# EAGLE design HAN_DE10-Lite_PS2SpeakerShield_001 (EAGLE 9.6.0)
CNAME: PS/2 keyboard shield for DE10-Lite; CREVISION: 1.0; DESIGNER: remko.welling@han.nl
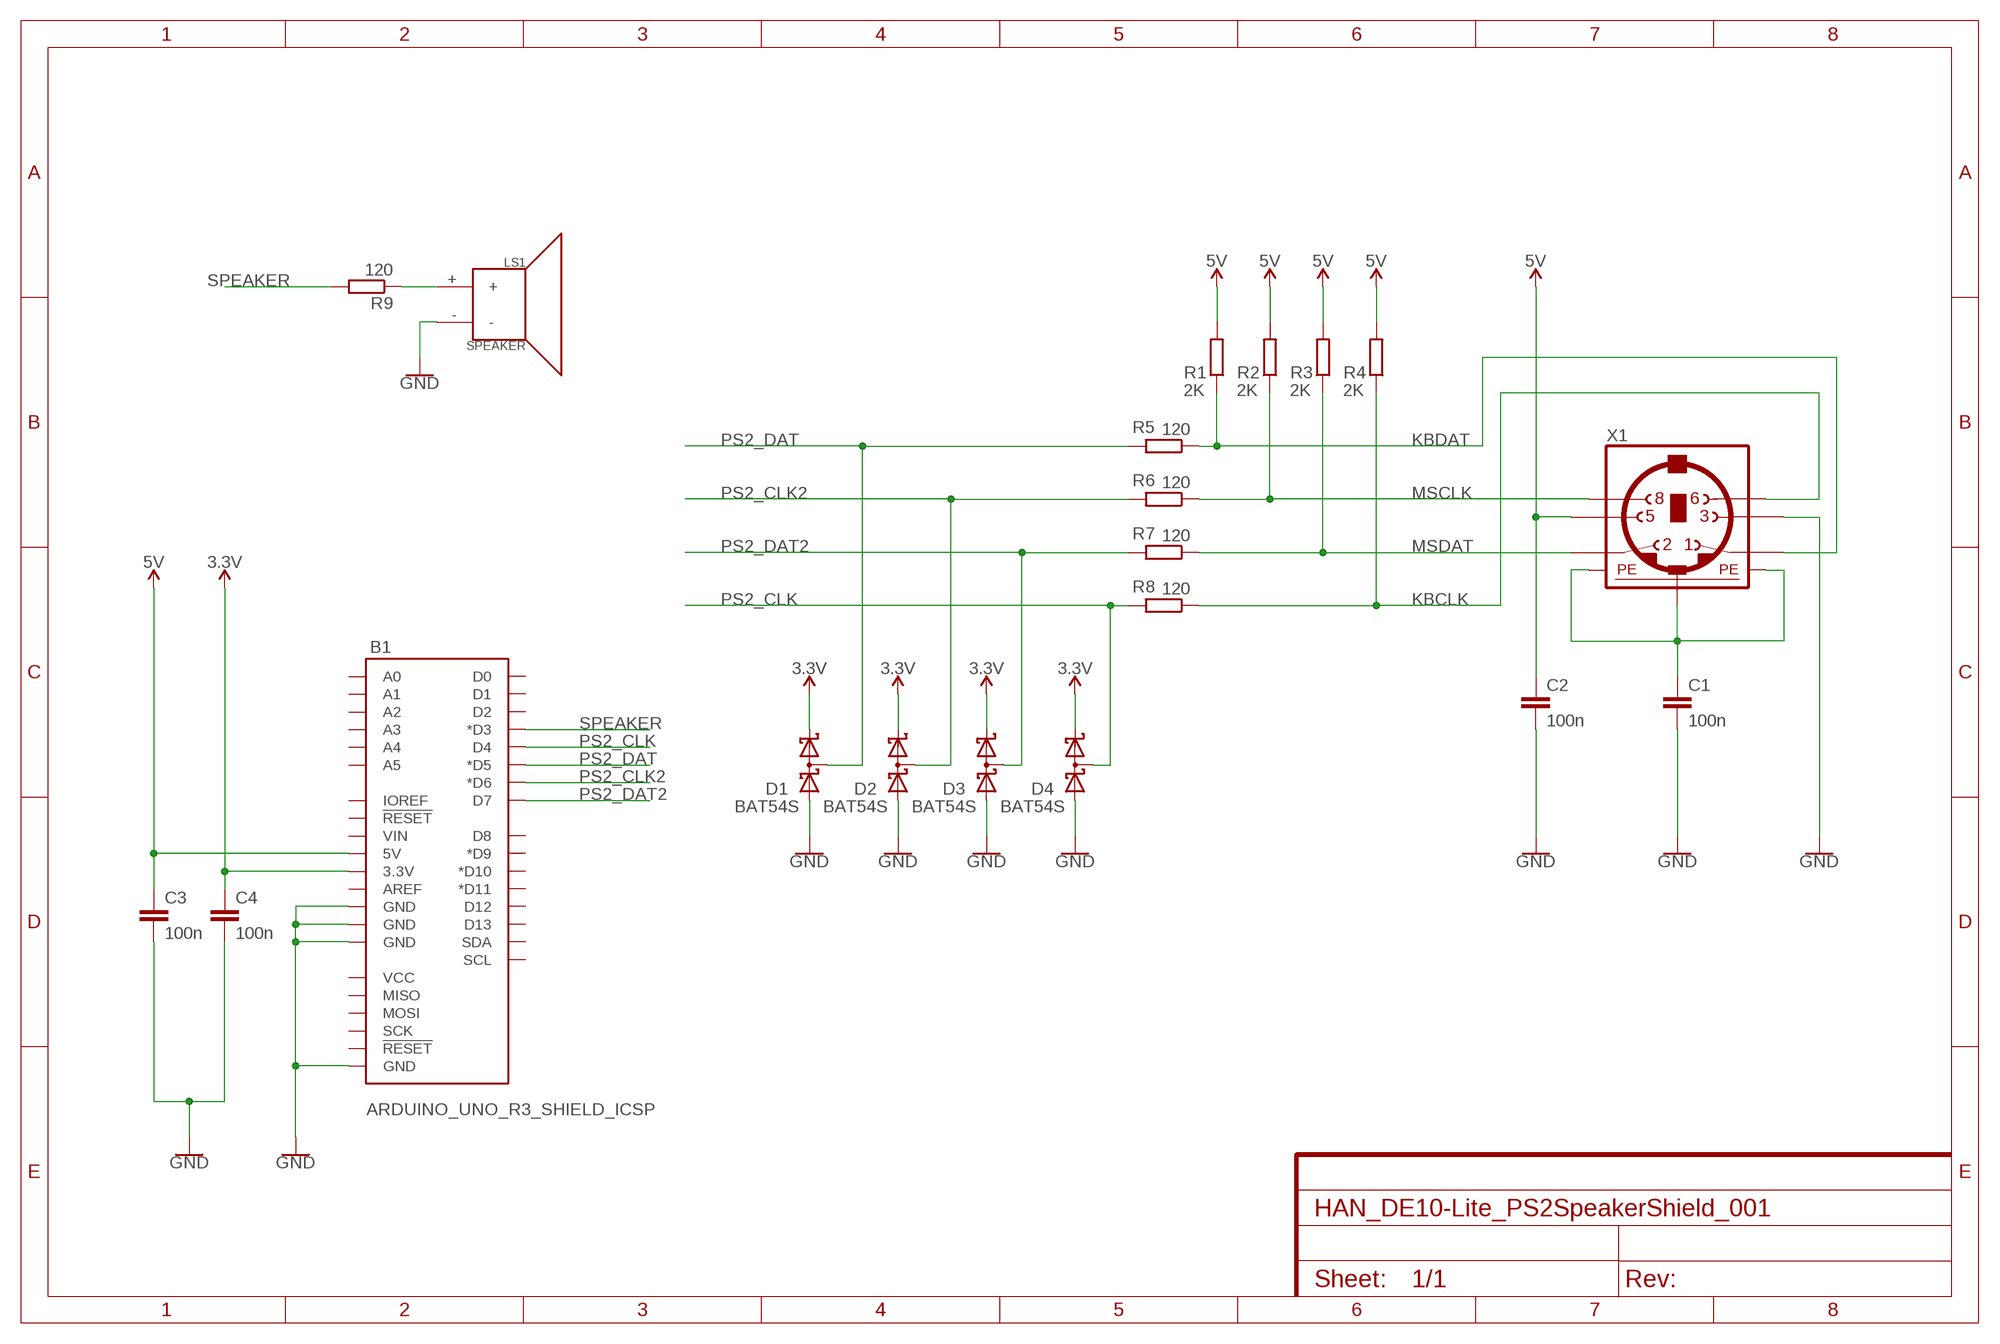
[diagram p0: schematic, sheet 1]

## Parts
B1  ARDUINO_UNO_R3_SHIELD_ICSP  [UNO_R3_SHIELD_ICSP]
C1  100n  C-EUC1206  [C1206]
C2  100n  C-EUC1206  [C1206]
C3  100n  C-EUC1206  [C1206]
C4  100n  C-EUC1206  [C1206]
D1  BAT54S  [SOT23]
D2  BAT54S  [SOT23]
D3  BAT54S  [SOT23]
D4  BAT54S  [SOT23]
LS1  SPEAKER  [PCB_MOUNT_SPEAKER]
R1  2K  R-EU_M1206  [M1206]
R2  2K  R-EU_M1206  [M1206]
R3  2K  R-EU_M1206  [M1206]
R4  2K  R-EU_M1206  [M1206]
R5  120  R-EU_M1206  [M1206]
R6  120  R-EU_M1206  [M1206]
R7  120  R-EU_M1206  [M1206]
R8  120  R-EU_M1206  [M1206]
R9  120  R-EU_M1206  [M1206]
X1  MINI_DIN_6  [M_DIN6]

## Nets
3.3V: B1.3.3V C4.1 D1.2(K2) D2.2(K2) D3.2(K2) D4.2(K2)
5V: B1.5V C2.1 C3.1 R1.2 R2.2 R3.2 R4.2 X1.5
GND: B1.GND@0(GND) B1.GND@1(GND) B1.GND@2(GND) B1.GND_ICSP(GND) C1.2 C2.2 C3.2 C4.2 D1.1(A1) D2.1(A1) D3.1(A1) D4.1(A1) LS1.- X1.3
KBCLK: R4.1 R8.1 X1.6
KBDAT: R1.1 R5.1 X1.1
MSCLK: R2.1 R6.1 X1.8
MSDAT: R3.1 R7.1 X1.2
N$2: LS1.+ R9.1
N$5: C1.1 X1.SH1(PE1) X1.SH2(PE2) X1.SH3(PE3)
PS2_CLK: B1.D4 D4.3(K1A2) R8.2
PS2_CLK2: B1.D6(*D6) D2.3(K1A2) R6.2
PS2_DAT: B1.D5(*D5) D1.3(K1A2) R5.2
PS2_DAT2: B1.D7 D3.3(K1A2) R7.2
SPEAKER: B1.D3(*D3) R9.2
Unconnected: B1.5V_ICSP(VCC) B1.A0 B1.A1 B1.A2 B1.A3 B1.A4 B1.A5 B1.AREF B1.D2 B1.D8 B1.D9(*D9) B1.D10(*D10) B1.D11(*D11) B1.D12 B1.D13 B1.IOREF B1.MISO B1.MOSI B1.RES(!RESET!) B1.RST_ICSP(!RESET!) B1.RX(D0) B1.SCK B1.SCL B1.SDA B1.TX(D1) B1.VIN

## Library data of the parts
B1 = SparkFun-Boards:ARDUINO_UNO_R3_SHIELD_ICSP: Arduino R3 Shield Footprint with ICSP Header Includes pins for 6-pin (2x3) ICSP Header. Compatible with Leonardo boards that require SPI pin connections via this header. SparkFun Products: CryptoShield <https://www.sparkfun.com/products/13183> microSD Shield <https://www.sparkfun.com/products/12761> R3 Stackable Headers Kit <https://www.sparkfun.com/products/1417>
C1-C4 = rcl:C-EU: CAPACITOR, European symbol; SPICEPREFIX: C
D1-D4 = nxp_60:BAT54S: Schottky barrier (double) diodes Planar Schottky barrier diodes encapsulated in a SOT23 small plastic SMD package. Single diodes and double diodes with different pinning are available. AAL Eindhoven MK
LS1 = PE1MEW:SPEAKER: Speaker Generic 2-terminal loudspeakers SparkFun Products Speaker - PCB Mount <https://www.sparkfun.com/products/11089> (COM-11089); PROD_ID: COMP-11789; SF_SKU: COM-11089
R1-R9 = rcl:R-EU_: RESISTOR, European symbol; SPICEPREFIX: R
X1 = mini_din:MINI_DIN_6

## Board
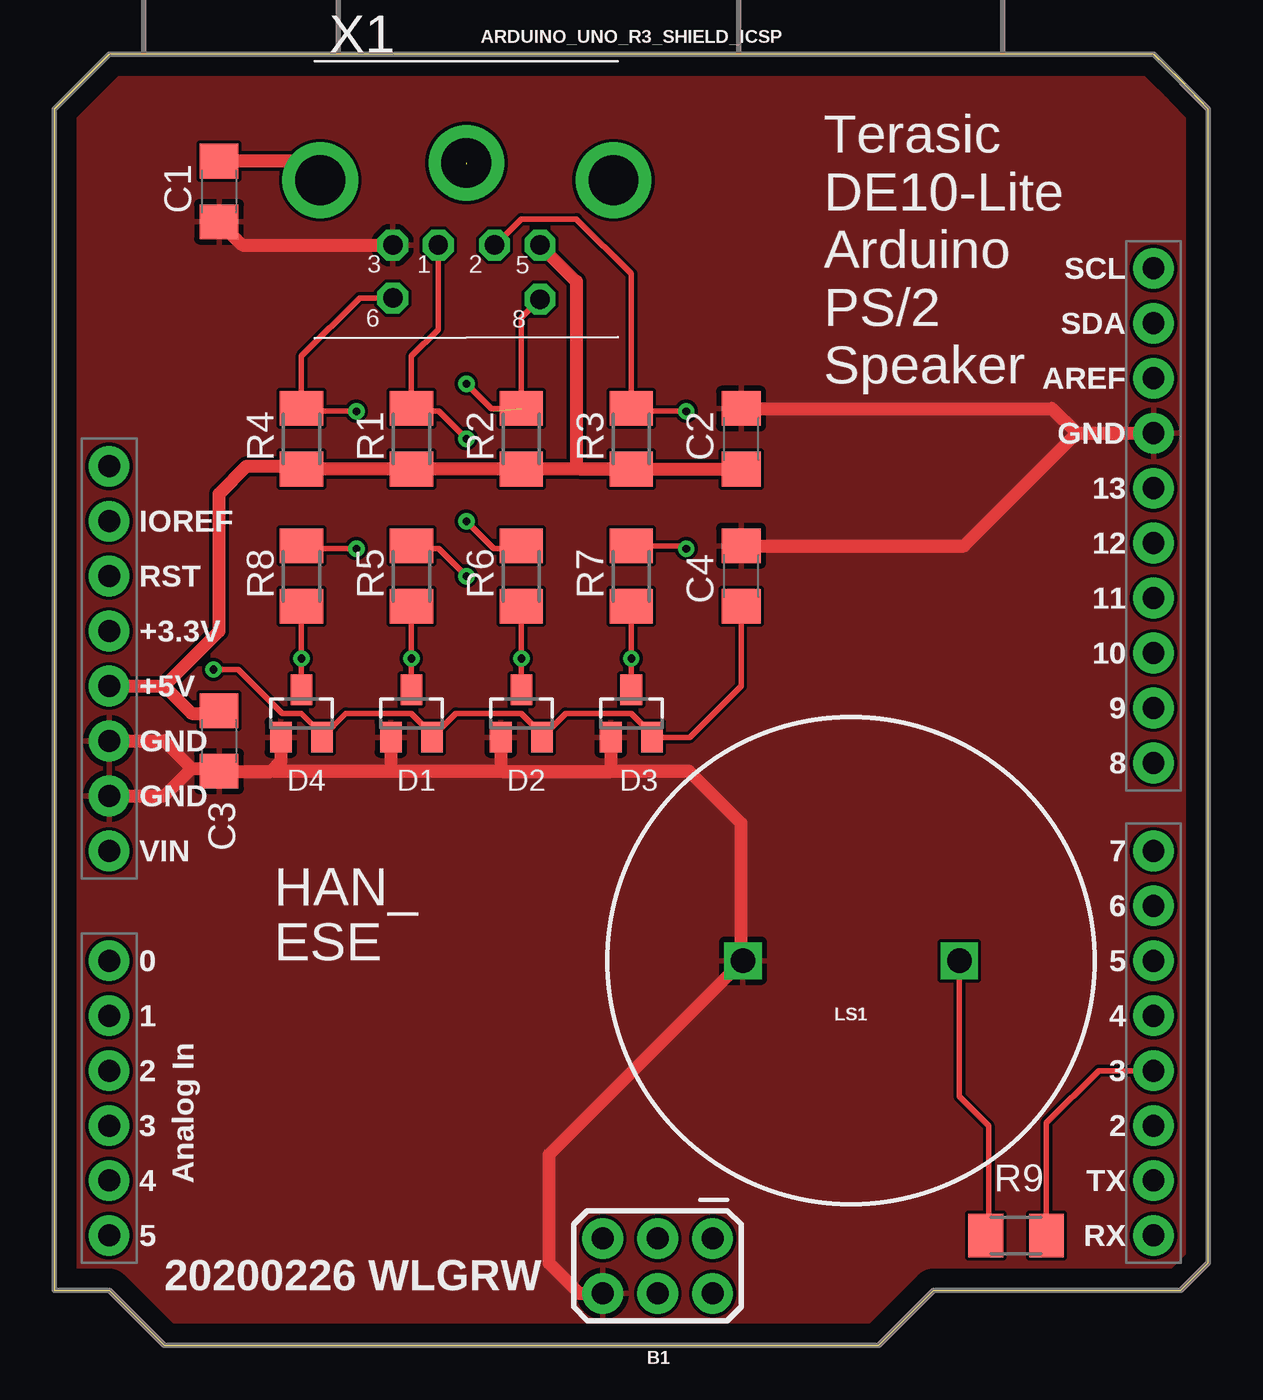
[diagram p1: board, top side]
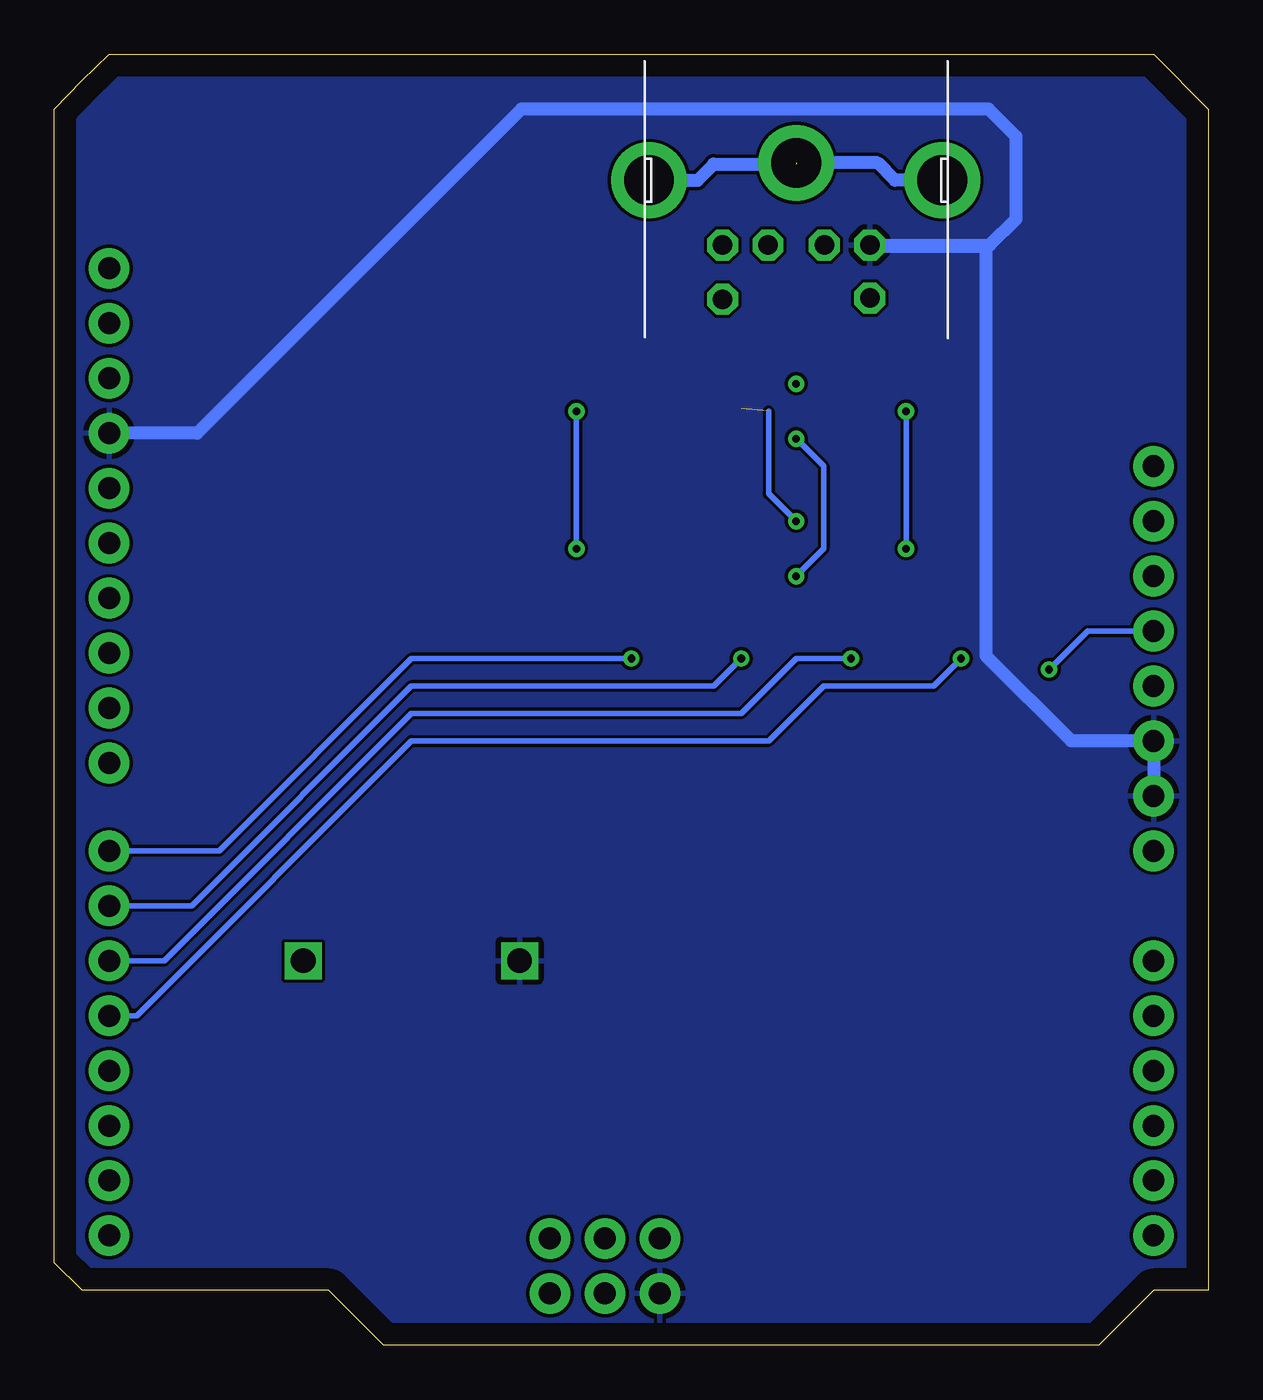
[diagram p2: board, bottom side, seen from below]

Size 53.34 x 59.69 mm. Coordinates in mm from the lower left corner, seen from the top.
Outline: 0,2.54 2.54,2.54 5.08,0 38.1,0 40.64,2.54 52.05,2.54 53.34,3.81 53.34,57.15 52.05,58.47 50.8,59.69 2.54,59.69 0,57.15 0,2.54
Copper layers (1*16): Top 0.035mm / dielectric 1.5mm / Bottom 0.035mm
Design rules "default": minimum track width 6mil, minimum drill 0.35mm, track to track 6mil, track to pad 6mil, pad to pad 6mil, via to via 6mil, smd to smd 6mil, copper to edge 40mil, drill to drill 6mil, minimum pad ring 10mil, minimum via ring 8mil, stop-mask expansion 4mil, vias tented up to drill 0mil, thermal gap 10mil

### Footprints (pad centres in the part's own frame; a part is rotated, then mirrored left to right if it is on the bottom)
UNO_R3_SHIELD_ICSP = drill 1.016 pad 1.88: 3.3V 24.13,-3.81; 5V 24.13,-1.27; 5V_ICSP -3.76,26.81; A0 24.13,11.43; A1 24.13,13.97; A2 24.13,16.51; A3 24.13,19.05; A4 24.13,21.59; A5 24.13,24.13; AREF -24.13,-15.494; D2 -24.13,19.05; D3 -24.13,16.51; D4 -24.13,13.97; D5 -24.13,11.43; D6 -24.13,8.89; D7 -24.13,6.35; D8 -24.13,2.286; D9 -24.13,-0.254; D10 -24.13,-2.794; D11 -24.13,-5.334; D12 -24.13,-7.874; D13 -24.13,-10.414; GND@0 24.13,1.27; GND@1 24.13,3.81; GND@2 -24.13,-12.954; GND_ICSP 1.32,26.81; IOREF 24.13,-8.89; MISO -3.76,24.27; MOSI -1.22,26.81; NC 24.13,-11.43; RES 24.13,-6.35; RST_ICSP 1.32,24.27; RX -24.13,24.13; SCK -1.22,24.27; SCL -24.13,-20.574; SDA -24.13,-18.034; TX -24.13,21.59; VIN 24.13,6.35
C1206 = smd 1.6 x 1.8: 1 -1.4,0; 2 1.4,0
SOT23 = smd 1 x 1.4: 1 -0.95,-1.1; 2 0.95,-1.1; 3 0,1.1
PCB_MOUNT_SPEAKER = drill 1.143 square: + -5,0; - 5,0
M1206 = smd 1.6 x 2: 1 -1.4,0; 2 1.4,0
M_DIN6 = drill 0.9 pad 1.422 octagon: 1 -1.3,-3.75; 2 1.3,-3.75; 3 -3.4,-3.75; 5 3.4,-3.75; 6 -3.4,-6.2; 8 3.4,-6.25 | drill 2.3 pad 3.5: SH1 6.8,-0.75; SH2 0,0.05; SH3 -6.75,-0.75

### Placement (x,y rotation side)
B1  26.67,29.21 180 top
C1  7.62,53.34 270 top
C2  31.75,41.91 90 top
C3  7.62,27.94 270 top
C4  31.75,35.56 90 top
D1  16.51,29.21 0 top
D2  21.59,29.21 0 top
D3  26.67,29.21 0 top
D4  11.43,29.21 0 top
LS1  36.83,17.78 180 top
R1  16.51,41.91 270 top
R2  21.59,41.91 270 top
R3  26.67,41.91 270 top
R4  11.43,41.91 270 top
R5  16.51,35.56 270 top
R6  21.59,35.56 270 top
R7  26.67,35.56 270 top
R8  11.43,35.56 270 top
R9  44.45,5.08 0 top
X1  19.05,54.61 0 top

### Tracks (layer width: path | path; a pad name or v marks a point on that pad's centre or on a via)
3.3V  (via drill 0.35)
  Top 0.254: v7.37,31.24 8.51,31.24 10.54,29.21 11.43,29.21 12.38,28.26 D4.2 13.48,29.21 16.51,29.21 17.46,28.26 D1.2 18.56,29.21 21.59,29.21 22.54,28.26 D2.2 23.64,29.21 26.67,29.21 27.62,28.26 D3.2 29.38,28.11 31.75,30.48 C4.1
  Bottom 0.254: v7.37,31.24 5.59,33.02 B1.3.3V
5V
  Top 0.61: X1.5 24.13,49.18 24.13,40.64 24.26,40.51 R3.2 | R3.2 R2.2 R1.2 R4.2 11.3,40.64 8.89,40.64 7.62,39.37 7.62,33.02 5.08,30.48 | B1.5V 5.08,30.48 | 5.08,30.48 6.35,29.21 7.49,29.21 C3.1 | R3.2 C2.1
GND
  Top 0.61: C1.2 8.7,50.86 X1.3 | B1.GND@1 5.08,25.4 6.35,26.67 | 6.35,26.67 7.49,26.67 C3.2 10.03,26.54 | B1.GND@0 5.08,27.94 6.35,26.67 | 10.03,26.54 10.48,26.99 D4.1 | D3.1 25.72,26.54 | 20.7,26.54 25.72,26.54 | 20.7,26.54 15.62,26.54 | 15.62,26.54 10.03,26.54 | D2.1 20.64,26.6 20.7,26.54 | D1.1 15.56,26.6 15.62,26.54 | C4.2 42.04,36.96 47.24,42.16 | 47.24,42.16 B1.GND@2 | C2.2 46.1,43.31 47.24,42.16 | 25.72,26.54 29.34,26.54 31.75,24.13 31.75,17.86 LS1.- 22.86,8.81 22.86,3.81 24.27,2.4 B1.GND_ICSP
  Bottom 0.61: B1.GND@1 B1.GND@0 6.35,27.94 10.29,31.88 10.29,50.8 15.59,50.8 X1.3 10.1,50.86 8.89,52.07 8.89,55.88 10.16,57.15 31.75,57.15 46.74,42.16 B1.GND@2
  pour Top: 0,59.69 53.34,59.69 53.34,0 0,0
  pour Bottom: 0,59.69 53.34,59.69 53.34,1.27 53.34,0 0,0
KBCLK  (via drill 0.35)
  Top 0.254: X1.6 14.12,48.41 11.43,45.72 R4.1 11.56,43.18 v13.97,43.18 | R8.1 11.56,36.83 v13.97,36.83
  Bottom 0.254: v13.97,43.18 v13.97,36.83
KBDAT  (via drill 0.35)
  Top 0.254: X1.1 17.75,46.96 16.51,45.72 R1.1 16.64,43.18 17.78,43.18 v19.05,41.91 | R5.1 16.64,36.83 17.78,36.83 v19.05,35.56
  Bottom 0.254: v19.05,41.91 17.78,40.64 17.78,36.83 v19.05,35.56
MSCLK  (via drill 0.35)  (1 unrouted)
  Top 0.254: X1.8 21.59,47.5 R2.1 20.19,43.31 v19.05,44.45 | 21.72,36.83 R6.1 21.46,36.83 20.32,36.83 v19.05,38.1
  Bottom 0.254: 20.32,43.18 20.32,39.37 v19.05,38.1
MSDAT  (via drill 0.35)
  Top 0.254: X1.2 20.38,50.86 21.59,52.07 24.13,52.07 26.67,49.53 R3.1 26.8,43.18 v29.21,43.18 | R7.1 29.08,36.96 v29.21,36.83
  Bottom 0.254: v29.21,43.18 v29.21,36.83
N$2
  Top 0.254: LS1.+ 41.83,11.51 43.18,10.16 43.18,5.21 R9.1
N$5  (1 unrouted)
  Top 0.61: X1.SH3 11.42,54.74 C1.1
  Bottom 0.61: X1.SH3 14.49,53.86 15.29,54.66 X1.SH2 | X1.SH1 23.61,53.86 22.86,54.61 19.05,54.61
PS2_CLK  (via drill 0.35)
  Top 0.254: R8.2 v11.43,31.75 D4.3
  Bottom 0.254: B1.D4 49.53,15.24 36.83,27.94 20.32,27.94 17.78,30.48 12.7,30.48 v11.43,31.75
PS2_CLK2  (via drill 0.35)
  Top 0.254: R6.2 v21.59,31.75 D2.3
  Bottom 0.254: v21.59,31.75 22.86,30.48 36.83,30.48 46.99,20.32 B1.D6
PS2_DAT  (via drill 0.35)
  Top 0.254: R5.2 v16.51,31.75 D1.3
  Bottom 0.254: v16.51,31.75 19.05,31.75 21.59,29.21 36.83,29.21 48.26,17.78 B1.D5
PS2_DAT2  (via drill 0.35)
  Top 0.254: R7.2 v26.67,31.75 D3.3
  Bottom 0.254: v26.67,31.75 36.83,31.75 45.72,22.86 B1.D7
SPEAKER
  Top 0.254: B1.D3 48.26,12.7 45.85,10.29 R9.2

### Text on the board
tNames: Terasic / DE10-Lite / Arduino / PS/2 / Speaker | HAN_ | ESE | 20200226 WLGRW